# Altium schematic sheet Fiber_interlock.SchDoc
size 420 x 297 mm; Address1: Address1; Address2: Address2; Address3: Address3; Address4: Address4; DocumentNumber: *Э3; SheetNumber: 10; SheetTotal: 14; DocumentType: Схема электрическая *
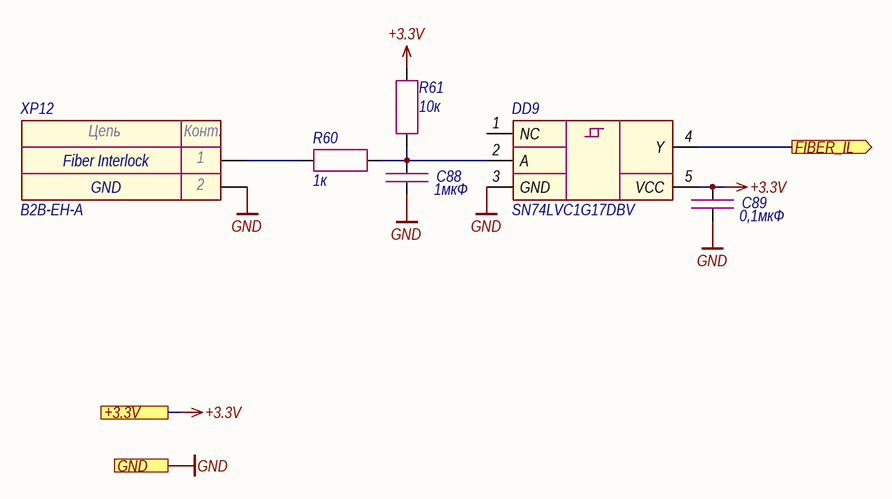
[diagram p0: Fiber_interlock.SchDoc]

## Parts
C88  1мкФ  [CAP_0603]
C89  0,1мкФ  [CAP_0603]
DD9  SN74LVC1G17DBV  [SOT-23-5]
R60  1к  [RES_0603]
R61  10к  [RES_0603]
XP12  B2B-EH-A  [B2B-EH-A]

## Ports
+3.3V (see Main[2D], Button[1D], Ethernet[3D], Flow_sensor[2C], LD_driver[1D], Power_supply[2C], RS-485[2C]), FIBER_IL (out, see Main[2D]), GND (see Main[2D], Button[1D], Column[1C], Ethernet[3D], Flow_sensor[2C], Guide_laser[1C], Indication[1C], LD_driver[1D], Power_supply[2C], RS-485[2C])

## Nets
+3.3V: C89.1 DD9.5(VCC) R61.2 ; port +3.3V
GND: C88.2 C89.2 DD9.3(GND) XP12.2 ; port GND
FIBER_IL: DD9.4(Y) ; port FIBER_IL
NetC88_1: C88.1 DD9.2(A) R60.2 R61.1
NetR60_1: R60.1 XP12.1

Not connected (* = marked no-connect by the designer): DD9 1(NC)

## Notes on the sheet
- (near XP12) Fiber Interlock
- GND
- Подп. и дата
- Инв. № дубл.
- Взам. инв. №
- Инв. № подл.
- Изм.
- Лист
- № докум.
- Подп.
- Дата
- Копировал
- Формат А3
- (in symbol Connector-2) Цепь; Конт.

## Library data of the parts
C88 = Capacitor: Manufacturer: Murata; Model: GRM188R61H105KAALD; Value: 1мкФ; Document: *
C89 = Capacitor: Manufacturer: Murata; Model: GRM188R71H104KA93D; Value: 0,1мкФ; Document: *
DD9 = SN74LVC1G17: Manufacturer: Texas Instruments; Model: SN74LVC1G17DBV; Document: *
R60 = Resistor: Manufacturer: Yageo; Model: RC0603FR-071KL; Value: 1к; Document: *
R61 = Resistor: Manufacturer: Yageo; Model: RC0603FR-0710KL; Value: 10к; Document: *
XP12 = Connector-2: Manufacturer: JST; Model: B2B-EH-A; Document: *